# Altium schematic sheet CON_MC_XMC_J14_64PIN.SchDoc
size A4
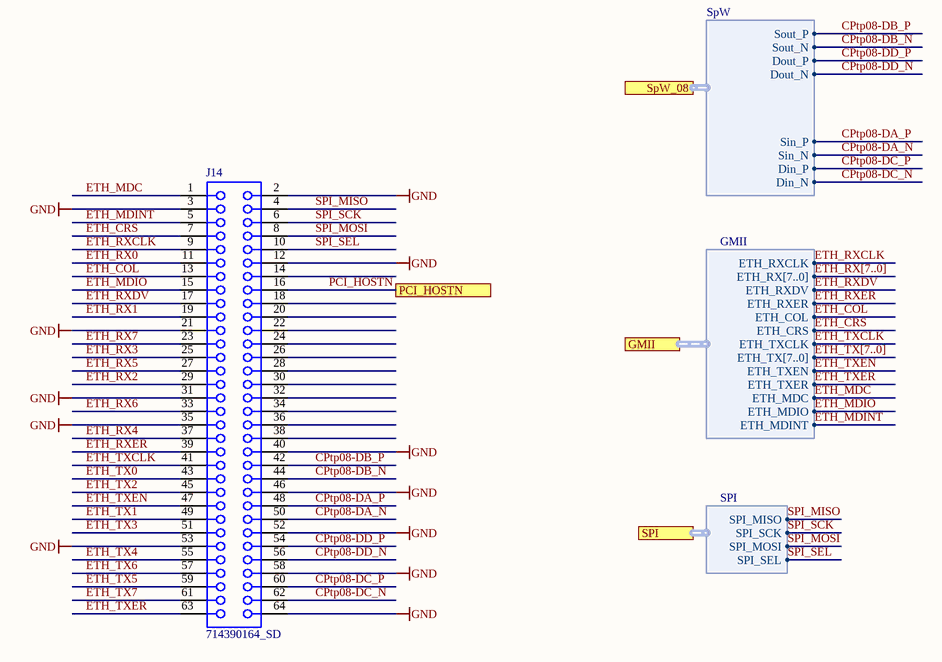
[diagram p0: CON_MC_XMC_J14_64PIN.SchDoc]

## Parts
J14  714390164_SD  [BTB1-2V64F]

## Ports
GMII (harness GMII), PCI_HOSTN, SPI (harness SPI), SpW_08 (harness SpW)

## Harnesses
GMII: ETH_RXCLK, ETH_RX[7..0], ETH_RXDV, ETH_RXER, ETH_COL, ETH_CRS, ETH_TXCLK, ETH_TX[7..0], ETH_TXEN, ETH_TXER, ETH_MDC, ETH_MDIO, ETH_MDINT
SPI: SPI_MISO, SPI_SCK, SPI_MOSI, SPI_SEL
SpW: Sout_P, Sout_N, Dout_P, Dout_N, Sin_P, Sin_N, Din_P, Din_N

## Nets
GND: J14.2 J14.3 J14.12 J14.21 J14.31 J14.35 J14.40 J14.46 J14.52 J14.53 J14.58 J14.64
CPtp08-DA_N: J14.50 ; port SpW_08.Sin_N
CPtp08-DA_P: J14.48 ; port SpW_08.Sin_P
CPtp08-DB_N: J14.44 ; port SpW_08.Sout_N
CPtp08-DB_P: J14.42 ; port SpW_08.Sout_P
CPtp08-DC_N: J14.62 ; port SpW_08.Din_N
CPtp08-DC_P: J14.60 ; port SpW_08.Din_P
CPtp08-DD_N: J14.56 ; port SpW_08.Dout_N
CPtp08-DD_P: J14.54 ; port SpW_08.Dout_P
ETH_COL: J14.13 ; port GMII.ETH_COL
ETH_CRS: J14.7 ; port GMII.ETH_CRS
ETH_MDC: J14.1 ; port GMII.ETH_MDC
ETH_MDINT: J14.5 ; port GMII.ETH_MDINT
ETH_MDIO: J14.15 ; port GMII.ETH_MDIO
ETH_RX0: J14.11
ETH_RX1: J14.19
ETH_RX2: J14.29
ETH_RX3: J14.25
ETH_RX4: J14.37
ETH_RX5: J14.27
ETH_RX6: J14.33
ETH_RX7: J14.23
ETH_RXCLK: J14.9 ; port GMII.ETH_RXCLK
ETH_RXDV: J14.17 ; port GMII.ETH_RXDV
ETH_RXER: J14.39 ; port GMII.ETH_RXER
ETH_TX0: J14.43
ETH_TX1: J14.49
ETH_TX2: J14.45
ETH_TX3: J14.51
ETH_TX4: J14.55
ETH_TX5: J14.59
ETH_TX6: J14.57
ETH_TX7: J14.61
ETH_TXCLK: J14.41 ; port GMII.ETH_TXCLK
ETH_TXEN: J14.47 ; port GMII.ETH_TXEN
ETH_TXER: J14.63 ; port GMII.ETH_TXER
PCI_HOSTN: J14.16 ; port PCI_HOSTN
SPI_MISO: J14.4 ; port SPI.SPI_MISO
SPI_MOSI: J14.8 ; port SPI.SPI_MOSI
SPI_SCK: J14.6 ; port SPI.SPI_SCK
SPI_SEL: J14.10 ; port SPI.SPI_SEL

Not connected (* = marked no-connect by the designer): J14 14 18 20 22 24 26 28 30 32 34 36 38

## Buses and harness runs
bus ETH_RX[7..0]
bus ETH_TX[7..0]

## Library data of the parts
J14 = CMP-0001-00081-1: Board-to-Board Connector, Vertical, 2-Row, Pitch 1mm, 64-Position, Female; Mating Connector: Molex-714360164; ClassName: Board Template Connector; Datasheet Version: Apr-2006; Package Reference: BTB1-2V64F; Publisher: Altium; Component Kind: Standard